# EAGLE schematic Mk4 Prototype (EAGLE 9.0.1)
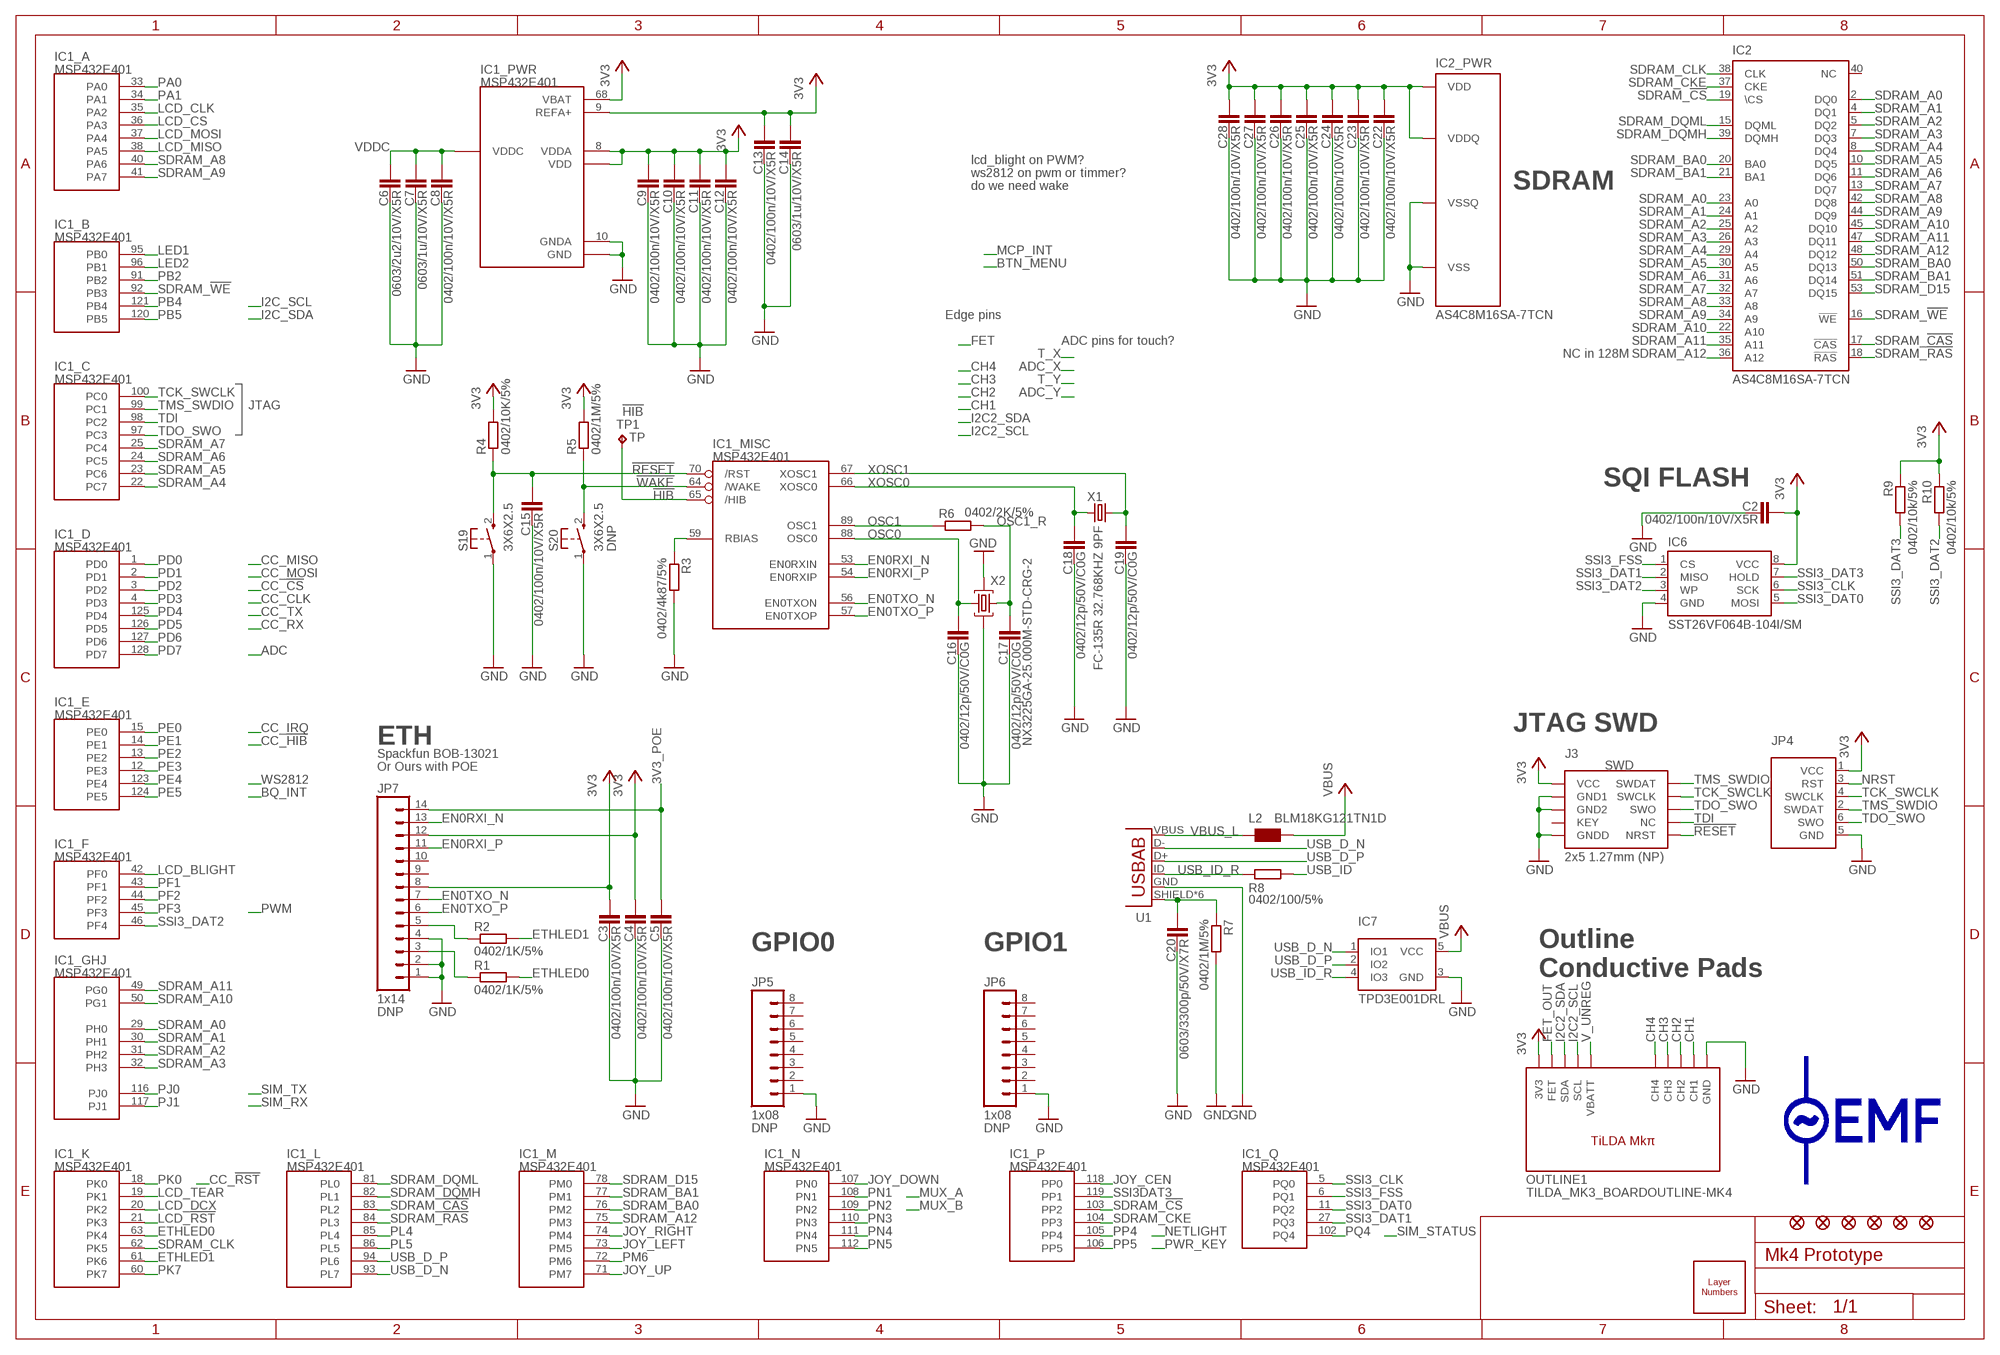
[diagram p0: schematic, sheet 1, part 1 of 2]
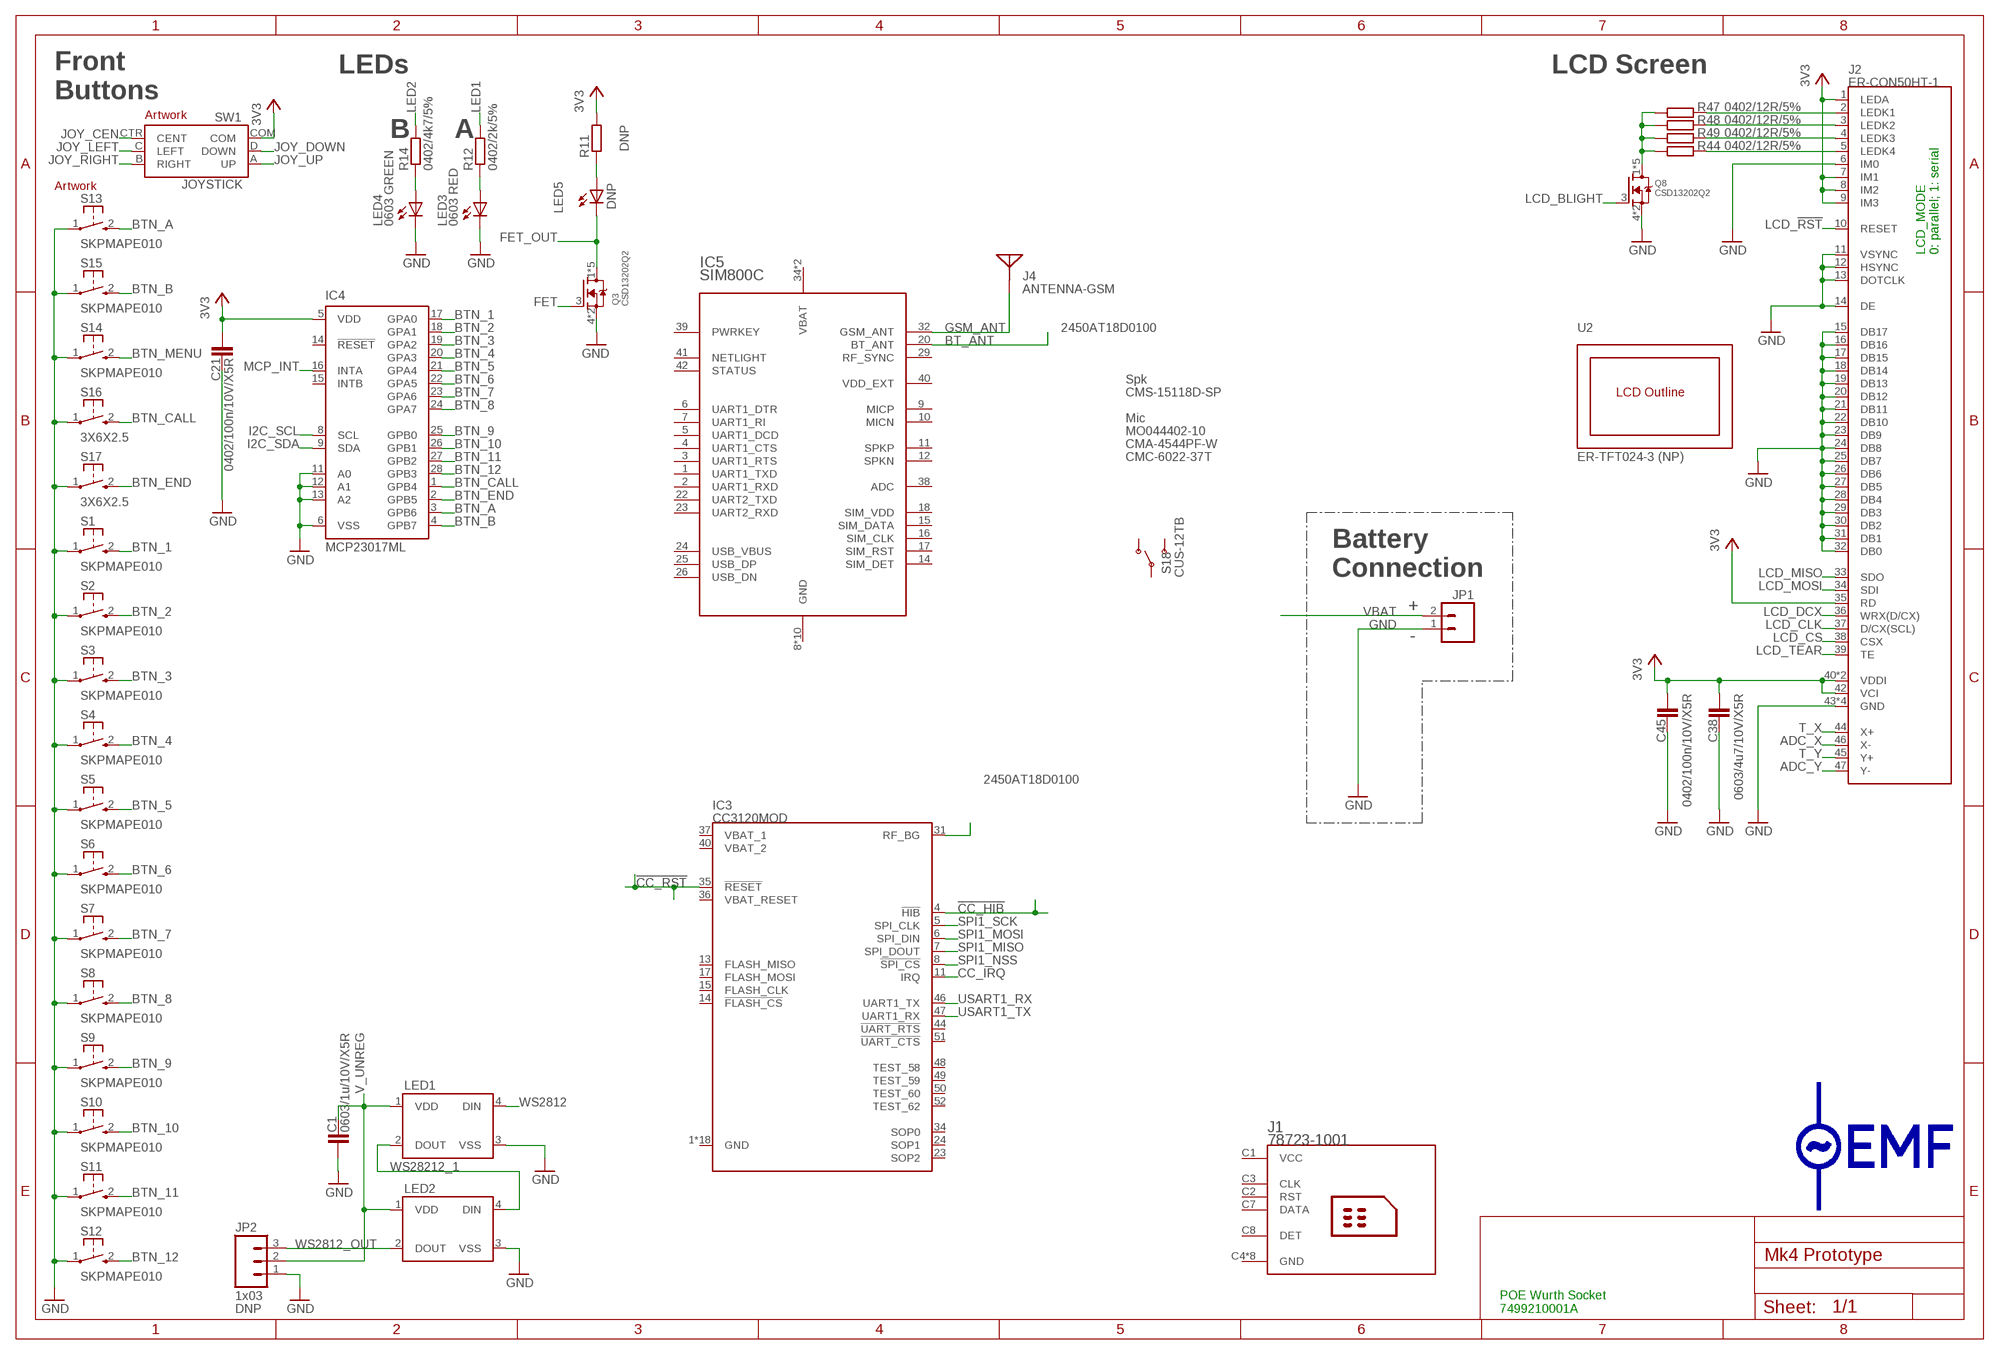
[diagram p1: schematic, sheet 1, part 2 of 2]

## Parts
ARTWORK1  ARTWORK_JOYSTICK  [TILDA_ARTWORK_JOYSTICK]
ARTWORK2  ARTWORK_KEYPAD  [TILDA_ARTWORK_KEYPAD]
C1  0603/1u/10V/X5R  C-EUC0603K-SMALL  [C0603K-SMALL]
C2  0402/100n/10V/X5R  C-EUC0402-SMALLER  [C0402-SMALLER]
C3  0402/100n/10V/X5R  C-EUC0402-SMALLER  [C0402-SMALLER]
C4  0402/100n/10V/X5R  C-EUC0402-SMALLER  [C0402-SMALLER]
C5  0402/100n/10V/X5R  C-EUC0402-SMALLER  [C0402-SMALLER]
C6  0603/2u2/10V/X5R  C-EUC0603K-SMALL  [C0603K-SMALL]
C7  0603/1u/10V/X5R  C-EUC0603K-SMALL  [C0603K-SMALL]
C8  0402/100n/10V/X5R  C-EUC0402-SMALLER  [C0402-SMALLER]
C9  0402/100n/10V/X5R  C-EUC0402-SMALLER  [C0402-SMALLER]
C10  0402/100n/10V/X5R  C-EUC0402-SMALLER  [C0402-SMALLER]
C11  0402/100n/10V/X5R  C-EUC0402-SMALLER  [C0402-SMALLER]
C12  0402/100n/10V/X5R  C-EUC0402-SMALLER  [C0402-SMALLER]
C13  0402/100n/10V/X5R  C-EUC0402-SMALLER  [C0402-SMALLER]
C14  0603/1u/10V/X5R  C-EUC0603K-SMALL  [C0603K-SMALL]
C15  0402/100n/10V/X5R  C-EUC0402-SMALLER  [C0402-SMALLER]
C16  0402/12p/50V/C0G  C-EUC0402-SMALLER  [C0402-SMALLER]
C17  0402/12p/50V/C0G  C-EUC0402-SMALLER  [C0402-SMALLER]
C18  0402/12p/50V/C0G  C-EUC0402-SMALLER  [C0402-SMALLER]
C19  0402/12p/50V/C0G  C-EUC0402-SMALLER  [C0402-SMALLER]
C20  0603/3300p/50V/X7R  C-EUC0603K-SMALL  [C0603K-SMALL]
C21  0402/100n/10V/X5R  C-EUC0402-SMALLER  [C0402-SMALLER]
C22  0402/100n/10V/X5R  C-EUC0402-SMALLER  [C0402-SMALLER]
C23  0402/100n/10V/X5R  C-EUC0402-SMALLER  [C0402-SMALLER]
C24  0402/100n/10V/X5R  C-EUC0402-SMALLER  [C0402-SMALLER]
C25  0402/100n/10V/X5R  C-EUC0402-SMALLER  [C0402-SMALLER]
C26  0402/100n/10V/X5R  C-EUC0402-SMALLER  [C0402-SMALLER]
C27  0402/100n/10V/X5R  C-EUC0402-SMALLER  [C0402-SMALLER]
C28  0402/100n/10V/X5R  C-EUC0402-SMALLER  [C0402-SMALLER]
C38  0603/4u7/10V/X5R  C-EUC0603K-SMALL  [C0603K-SMALL]
C45  0402/100n/10V/X5R  C-EUC0402-SMALLER  [C0402-SMALLER]
FID1  FIDUCIAL1X2.5-STOP  [FIDUCIAL-1X2.5-STOP]
FID2  FIDUCIAL1X2.5-STOP  [FIDUCIAL-1X2.5-STOP]
FID3  FIDUCIAL1X2.5-STOP  [FIDUCIAL-1X2.5-STOP]
FID4  FIDUCIAL1X2.5-STOP  [FIDUCIAL-1X2.5-STOP]
FID5  FIDUCIAL1X2.5-STOP  [FIDUCIAL-1X2.5-STOP]
FID6  FIDUCIAL1X2.5-STOP  [FIDUCIAL-1X2.5-STOP]
IC1  MSP432E401  [QFP128-0.4]
IC2  AS4C8M16SA-7TCN  MT48LCXXM16A2TG  [TSOP54-400]
IC3  CC3120MOD  [CC3100MOD-LWK]
IC4  MCP23017ML  [QFN28-ML_6X6MM]
IC5  SIM800C  [SIM800C]
IC6  SST26VF064B-104I/SM  SPI_FLASH-X25XXSMD1  [SO08-EIAJ]
IC7  TPD3E001DRL  [DRL-5]
J1  78723-1001  SIM-78723-1001-LWK  [MSIM-MOLEX-LWK]
J2  ER-CON50HT-1  ER-TFT024-3  [FH12-50S-0.5SH]
J3  2x5 1.27mm (NP)  SWD_SHROUD-PINHEAD  [PINHEAD_2X05_127]
J4  ANTENNA-GSM  [GSM-ANTENNA]
JP1  M02-JST-2MM-SMT  [JST-2-SMD]
JP2  1x03  M03LOCK  [1X03_LOCK]
JP4  (NP)  TC2030-SWDNL  [TC2030-MCP-NL]
JP5  1x08  M08LOCK  [1X08_LOCK]
JP6  1x08  M08LOCK  [1X08_LOCK]
JP7  1x14  M14LOCK  [1X14_LOCK]
L2  BLM18KG121TN1D  WE-CBF_0805  [WUERTH-0805]
LAYERS1  LAYER_NUMBRS_4_SMALL  [LAYER_NUMBERS_4_SMALL]
LED1  WS2812B  [WS2812B]
LED2  WS2812B  [WS2812B]
LED3  0603 RED  LED0603-CORRECT  [LED-0603-CORRECT]
LED4  0603 GREEN  LED0603-CORRECT  [LED-0603-CORRECT]
LED5  LED5MM  [LED5MM]
OUTLINE1  TILDA_MK3_BOARDOUTLINE-MK4  [TILDA_MK4_OUTLINE]
Q3  CSD13202Q2  [Q2]
Q8  CSD13202Q2  [Q2]
R1  0402/1K/5%  R-EU_R0402-SMALLER  [R0402-SMALLER]
R2  0402/1K/5%  R-EU_R0402-SMALLER  [R0402-SMALLER]
R3  0402/4k87/5%  R-EU_R0402-SMALLER  [R0402-SMALLER]
R4  0402/10K/5%  R-EU_R0402-SMALLER  [R0402-SMALLER]
R5  0402/1M/5%  R-EU_R0402-SMALLER  [R0402-SMALLER]
R6  0402/2K/5%  R-EU_R0402-SMALLER  [R0402-SMALLER]
R7  0402/1M/5%  R-EU_R0402-SMALLER  [R0402-SMALLER]
R8  0402/100/5%  R-EU_R0402-SMALLER  [R0402-SMALLER]
R9  0402/10k/5%  R-EU_R0402-SMALLER  [R0402-SMALLER]
R10  0402/10k/5%  R-EU_R0402-SMALLER  [R0402-SMALLER]
R11  R-EU_0309/10  [0309/10]
R12  0402/2k/5%  R-EU_R0402-SMALLER  [R0402-SMALLER]
R14  0402/4k7/5%  R-EU_R0402-SMALLER  [R0402-SMALLER]
R44  0402/12R/5%  R-EU_R0402-SMALLER  [R0402-SMALLER]
R47  0402/12R/5%  R-EU_R0402-SMALLER  [R0402-SMALLER]
R48  0402/12R/5%  R-EU_R0402-SMALLER  [R0402-SMALLER]
R49  0402/12R/5%  R-EU_R0402-SMALLER  [R0402-SMALLER]
S1  SKPMAPE010  TAC_SWITCH1-SKPMAPE010  [SKPMAPE010]
S2  SKPMAPE010  TAC_SWITCH1-SKPMAPE010  [SKPMAPE010]
S3  SKPMAPE010  TAC_SWITCH1-SKPMAPE010  [SKPMAPE010]
S4  SKPMAPE010  TAC_SWITCH1-SKPMAPE010  [SKPMAPE010]
S5  SKPMAPE010  TAC_SWITCH1-SKPMAPE010  [SKPMAPE010]
S6  SKPMAPE010  TAC_SWITCH1-SKPMAPE010  [SKPMAPE010]
S7  SKPMAPE010  TAC_SWITCH1-SKPMAPE010  [SKPMAPE010]
S8  SKPMAPE010  TAC_SWITCH1-SKPMAPE010  [SKPMAPE010]
S9  SKPMAPE010  TAC_SWITCH1-SKPMAPE010  [SKPMAPE010]
S10  SKPMAPE010  TAC_SWITCH1-SKPMAPE010  [SKPMAPE010]
S11  SKPMAPE010  TAC_SWITCH1-SKPMAPE010  [SKPMAPE010]
S12  SKPMAPE010  TAC_SWITCH1-SKPMAPE010  [SKPMAPE010]
S13  SKPMAPE010  TAC_SWITCH1-SKPMAPE010  [SKPMAPE010]
S14  SKPMAPE010  TAC_SWITCH1-SKPMAPE010  [SKPMAPE010]
S15  SKPMAPE010  TAC_SWITCH1-SKPMAPE010  [SKPMAPE010]
S16  3X6X2.5  TAC_SWITCH1-3X6X2.5  [TACTILE_SWITCH_SMD_3X6X2.5H]
S17  3X6X2.5  TAC_SWITCH1-3X6X2.5  [TACTILE_SWITCH_SMD_3X6X2.5H]
S18  CUS-12TB  SWITCH-SPST-SMD-A  [SWITCH-SPST-SMD-A]
S19  3X6X2.5  TAC_SWITCH1-3X6X2.5  [TACTILE_SWITCH_SMD_3X6X2.5H]
S20  3X6X2.5  TAC_SWITCH1-3X6X2.5  [TACTILE_SWITCH_SMD_3X6X2.5H]
SW1  JOYSTICK  JOYSTICK_MINI_MULTICOM_NOSILK  [JOYSTICK_MULTICOMP_NOSILK]
TP1  TP  TPB1,27  [B1,27]
U1  USB-AB-LWK  [USB-AB-MICRO-SMD_LWK]
U2  ER-TFT024-3 (NP)  ER-TFT024-3-OUTLINE  [ER-TFT024-3]
X1  FC-135R 32.768KHZ 9PF  RESONATOR_EPSON_FC_145  [RESONATOR_EPSON_FC_145]
X2  NX3225GA-25.000M-STD-CRG-2  CRYSTAL-3.2-2.5  [CRYSTAL-3.2-2.5]

## Nets
3V3: C2.2 C3.2 C4.2 C9.2 C10.2 C11.2 C12.2 C13.2 C14.2 C21.2 C22.2 C23.2 C24.2 C25.2 C26.2 C27.2 C28.2 C38.2 C45.2 IC1.7(_PWR:VDD) IC1.8(_PWR:VDDA) IC1.9(_PWR:REFA+) IC1.16(_PWR:VDD) IC1.26(_PWR:VDD) IC1.28(_PWR:VDD) IC1.39(_PWR:VDD) IC1.47(_PWR:VDD) IC1.51(_PWR:VDD) IC1.52(_PWR:VDD) IC1.68(_PWR:VBAT) IC1.69(_PWR:VDD) IC1.79(_PWR:VDD) IC1.90(_PWR:VDD) IC1.101(_PWR:VDD) IC1.113(_PWR:VDD) IC1.122(_PWR:VDD) IC2.1(VDD) IC2.3(VDDQ) IC2.9(VDDQ) IC2.14(VDD) IC2.27(VDD) IC2.43(VDDQ) IC2.49(VDDQ) IC4.5(VDD) IC6.8(VCC) J2.1(LEDA) J2.7(IM1) J2.8(IM2) J2.9(IM3) J2.35(RD) J2.40(VDDI) J2.41(VDDI) J2.42(VCI) J3.1(VCC) JP4.1(VCC) JP7.8 JP7.12 OUTLINE1.3V3 R4.2 R5.2 R9.1 R10.1 R11.2 SW1.COM
3V3_POE: C5.2 JP7.14
!CC_HIB: IC3.4(!HIB)
!CC_RST: IC3.35(!RESET)
!HIB: IC1.65(_MISC:/HIB) TP1.TP
!RESET: C15.2 IC1.70(_MISC:/RST) J3.10(NRST) R4.1 S19.2
!WAKE: IC1.64(_MISC:/WAKE) R5.1 S20.2
ADC_X: J2.46(X-)
ADC_Y: J2.47(Y-)
BT_ANT: IC5.20(BT_ANT)
BTN_1: IC4.17(GPA0) S1.2
BTN_2: IC4.18(GPA1) S2.2
BTN_3: IC4.19(GPA2) S3.2
BTN_4: IC4.20(GPA3) S4.2
BTN_5: IC4.21(GPA4) S5.2
BTN_6: IC4.22(GPA5) S6.2
BTN_7: IC4.23(GPA6) S7.2
BTN_8: IC4.24(GPA7) S8.2
BTN_9: IC4.25(GPB0) S9.2
BTN_10: IC4.26(GPB1) S10.2
BTN_11: IC4.27(GPB2) S11.2
BTN_12: IC4.28(GPB3) S12.2
BTN_A: IC4.3(GPB6) S13.2
BTN_B: IC4.4(GPB7) S15.2
BTN_CALL: IC4.1(GPB4) S16.2
BTN_END: IC4.2(GPB5) S17.2
BTN_MENU: S14.2
CC_IRQ: IC3.11(IRQ)
CH1: OUTLINE1.CH4(CH1)
CH2: OUTLINE1.CH3(CH2)
CH3: OUTLINE1.CH2(CH3)
CH4: OUTLINE1.CH1(CH4)
EN0RXI_N [100R]: IC1.53(_MISC:EN0RXIN) JP7.13
EN0RXI_P [100R]: IC1.54(_MISC:EN0RXIP) JP7.11
EN0TXO_N [100R]: IC1.56(_MISC:EN0TXON) JP7.7
EN0TXO_P [100R]: IC1.57(_MISC:EN0TXOP) JP7.6
ETHLED0: IC1.63(_K:PK4) R1.2
ETHLED1: IC1.61(_K:PK6) R2.2
FET: Q3.3(G)
FET_OUT: LED5.K(C) OUTLINE1.FET Q3.1(D) Q3.2(D) Q3.5(D) Q3.6(D) Q3.EP1(D)
GND: C1.2 C2.1 C3.1 C4.1 C5.1 C6.1 C7.1 C8.1 C9.1 C10.1 C11.1 C12.1 C13.1 C14.1 C15.1 C16.1 C17.1 C18.1 C19.1 C20.1 C21.1 C22.1 C23.1 C24.1 C25.1 C26.1 C27.1 C28.1 C38.1 C45.1 IC1.10(_PWR:GNDA) IC1.17(_PWR:GND) IC1.48(_PWR:GND) IC1.55(_PWR:GND) IC1.58(_PWR:GND) IC1.80(_PWR:GND) IC1.114(_PWR:GND) IC2.6(VSSQ) IC2.12(VSSQ) IC2.28(VSS) IC2.41(VSS) IC2.46(VSSQ) IC2.52(VSSQ) IC2.54(VSS) IC4.6(VSS) IC4.11(A0) IC4.12(A1) IC4.13(A2) IC6.4(GND) IC7.3(GND) J2.6(IM0) J2.11(VSYNC) J2.12(HSYNC) J2.13(DOTCLK) J2.14(DE) J2.15(DB17) J2.16(DB16) J2.17(DB15) J2.18(DB14) J2.19(DB13) J2.20(DB12) J2.21(DB11) J2.22(DB10) J2.23(DB9) J2.24(DB8) J2.25(DB7) J2.26(DB6) J2.27(DB5) J2.28(DB4) J2.29(DB3) J2.30(DB2) J2.31(DB1) J2.32(DB0) J2.43(GND) J2.48(GND) J2.49(GND) J2.50(GND) J3.3(GND1) J3.5(GND2) J3.9(GNDD) JP1.1 JP2.1 JP4.5(GND) JP5.1 JP6.1 JP7.1 JP7.2 JP7.4 LED1.3(VSS) LED2.3(VSS) LED3.C LED4.C OUTLINE1.GND Q3.4(S) Q3.EP2(S) Q8.4(S) Q8.EP2(S) R3.2 R7.2 S1.1 S2.1 S3.1 S4.1 S5.1 S6.1 S7.1 S8.1 S9.1 S10.1 S11.1 S12.1 S13.1 S14.1 S15.1 S16.1 S17.1 S19.1 S20.1 U1.GND X2.2(GND) X2.4(GND)
GSM_ANT: IC5.32(GSM_ANT) J4.ANT
I2C2_SCL: OUTLINE1.SCL
I2C2_SDA: OUTLINE1.SDA
I2C_SCL: IC4.8(SCL)
I2C_SDA: IC4.9(SDA)
JOY_CEN: IC1.118(_P:PP0) SW1.CTR(CENT)
JOY_DOWN: IC1.107(_N:PN0) SW1.D(DOWN)
JOY_LEFT: IC1.73(_M:PM5) SW1.C(LEFT)
JOY_RIGHT: IC1.74(_M:PM4) SW1.B(RIGHT)
JOY_UP: IC1.71(_M:PM7) SW1.A(UP)
LCD_!RST: IC1.21(_K:PK3) J2.10(RESET)
LCD_BLIGHT: IC1.42(_F:PF0) Q8.3(G)
LCD_CLK: IC1.35(_A:PA2) J2.37(D/CX(SCL))
LCD_CS: IC1.36(_A:PA3) J2.38(CSX)
LCD_DCX: IC1.20(_K:PK2) J2.36(WRX(D/CX))
LCD_MISO: IC1.38(_A:PA5) J2.33(SDO)
LCD_MOSI: IC1.37(_A:PA4) J2.34(SDI)
LCD_TEAR: IC1.19(_K:PK1) J2.39(TE)
LED1: IC1.95(_B:PB0) R12.2
LED2: IC1.96(_B:PB1) R14.2
LEDK1: J2.2(LEDK1) R47.2
LEDK2: J2.3(LEDK2) R48.2
LEDK3: J2.4(LEDK3) R49.2
LEDK4: J2.5(LEDK4) R44.2
MCP_INT: IC4.16(INTA)
N$1: LED5.A R11.1
N$3: JP7.3 R1.1
N$4: JP7.5 R2.1
N$5: IC1.59(_MISC:RBIAS) R3.1
N$6: C20.2 R7.1 U1.SHIELD U1.SHIELD@0(SHIELD) U1.SHIELD@1(SHIELD) U1.SHIELD@2(SHIELD) U1.SHIELD@3(SHIELD) U1.SHIELD@5(SHIELD)
N$36: IC3.31(RF_BG)
N$51: LED4.A R14.1
N$52: LED3.A R12.1
N$64: Q8.1(D) Q8.2(D) Q8.5(D) Q8.6(D) Q8.EP1(D) R44.1 R47.1 R48.1 R49.1
NRST: JP4.3(RST)
OSC0: C16.2 IC1.88(_MISC:OSC0) X2.1(C1)
OSC1: IC1.89(_MISC:OSC1) R6.1
OSC1_R: C17.2 R6.2 X2.3(C2)
PA0: IC1.33(_A:PA0)
PA1: IC1.34(_A:PA1)
PB2: IC1.91(_B:PB2)
PB4: IC1.121(_B:PB4)
PB5: IC1.120(_B:PB5)
PD0: IC1.1(_D:PD0)
PD1: IC1.2(_D:PD1)
PD2: IC1.3(_D:PD2)
PD3: IC1.4(_D:PD3)
PD4: IC1.125(_D:PD4)
PD5: IC1.126(_D:PD5)
PD6: IC1.127(_D:PD6)
PD7: IC1.128(_D:PD7)
PE0: IC1.15(_E:PE0)
PE1: IC1.14(_E:PE1)
PE2: IC1.13(_E:PE2)
PE3: IC1.12(_E:PE3)
PE4: IC1.123(_E:PE4)
PE5: IC1.124(_E:PE5)
PF1: IC1.43(_F:PF1)
PF2: IC1.44(_F:PF2)
PF3: IC1.45(_F:PF3)
PJ0: IC1.116(_GHJ:PJ0)
PJ1: IC1.117(_GHJ:PJ1)
PK0: IC1.18(_K:PK0)
PK7: IC1.60(_K:PK7)
PL4: IC1.85(_L:PL4)
PL5: IC1.86(_L:PL5)
PM6: IC1.72(_M:PM6)
PN1: IC1.108(_N:PN1)
PN2: IC1.109(_N:PN2)
PN3: IC1.110(_N:PN3)
PN4: IC1.111(_N:PN4)
PN5: IC1.112(_N:PN5)
PP4: IC1.105(_P:PP4)
PP5: IC1.106(_P:PP5)
PQ4: IC1.102(_Q:PQ4)
SDRAM_!CAS: IC1.83(_L:PL2) IC2.17(!CAS)
SDRAM_!CS: IC1.103(_P:PP2) IC2.19(\CS)
SDRAM_!RAS: IC1.84(_L:PL3) IC2.18(!RAS)
SDRAM_!WE: IC1.92(_B:PB3) IC2.16(!WE)
SDRAM_A0: IC1.29(_GHJ:PH0) IC2.2(DQ0) IC2.23(A0)
SDRAM_A1: IC1.30(_GHJ:PH1) IC2.4(DQ1) IC2.24(A1)
SDRAM_A2: IC1.31(_GHJ:PH2) IC2.5(DQ2) IC2.25(A2)
SDRAM_A3: IC1.32(_GHJ:PH3) IC2.7(DQ3) IC2.26(A3)
SDRAM_A4: IC1.22(_C:PC7) IC2.8(DQ4) IC2.29(A4)
SDRAM_A5: IC1.23(_C:PC6) IC2.10(DQ5) IC2.30(A5)
SDRAM_A6: IC1.24(_C:PC5) IC2.11(DQ6) IC2.31(A6)
SDRAM_A7: IC1.25(_C:PC4) IC2.13(DQ7) IC2.32(A7)
SDRAM_A8: IC1.40(_A:PA6) IC2.33(A8) IC2.42(DQ8)
SDRAM_A9: IC1.41(_A:PA7) IC2.34(A9) IC2.44(DQ9)
SDRAM_A10: IC1.50(_GHJ:PG1) IC2.22(A10) IC2.45(DQ10)
SDRAM_A11: IC1.49(_GHJ:PG0) IC2.35(A11) IC2.47(DQ11)
SDRAM_A12: IC1.75(_M:PM3) IC2.36(A12) IC2.48(DQ12)
SDRAM_BA0: IC1.76(_M:PM2) IC2.20(BA0) IC2.50(DQ13)
SDRAM_BA1: IC1.77(_M:PM1) IC2.21(BA1) IC2.51(DQ14)
SDRAM_CKE: IC1.104(_P:PP3) IC2.37(CKE)
SDRAM_CLK: IC1.62(_K:PK5) IC2.38(CLK)
SDRAM_D15: IC1.78(_M:PM0) IC2.53(DQ15)
SDRAM_DQMH: IC1.82(_L:PL1) IC2.39(DQMH)
SDRAM_DQML: IC1.81(_L:PL0) IC2.15(DQML)
SPI1_MISO: IC3.7(SPI_DOUT)
SPI1_MOSI: IC3.6(SPI_DIN)
SPI1_NSS: IC3.8(!SPI_CS)
SPI1_SCK: IC3.5(SPI_CLK)
SSI3_CLK: IC1.5(_Q:PQ0) IC6.6(SCK)
SSI3_DAT0: IC1.11(_Q:PQ2) IC6.5(MOSI)
SSI3_DAT1: IC1.27(_Q:PQ3) IC6.2(MISO)
SSI3_DAT2: IC1.46(_F:PF4) IC6.3(WP) R10.2
SSI3_DAT3: IC6.7(HOLD) R9.2
SSI3_FSS: IC1.6(_Q:PQ1) IC6.1(CS)
SSI3DAT3: IC1.119(_P:PP1)
T_X: J2.44(X+)
T_Y: J2.45(Y+)
TCK_SWCLK: IC1.100(_C:PC0) J3.4(SWCLK) JP4.4(SWCLK)
TDI: IC1.98(_C:PC2) J3.8(NC)
TDO_SWO: IC1.97(_C:PC3) J3.6(SWO) JP4.6(SWO)
TMS_SWDIO: IC1.99(_C:PC1) J3.2(SWDAT) JP4.2(SWDAT)
USART1_RX: IC3.46(UART1_TX)
USART1_TX: IC3.47(UART1_RX)
USB_D_N [90R]: IC1.93(_L:PL7) IC7.1(IO1) U1.D-
USB_D_P [90R]: IC1.94(_L:PL6) IC7.2(IO2) U1.D+
USB_ID: R8.2
USB_ID_R: IC7.4(IO3) R8.1 U1.ID(USBID)
V_UNREG: C1.1 JP2.2 LED1.1(VDD) LED2.1(VDD) OUTLINE1.VBATT
VBAT: JP1.2
VBUS: IC7.5(VCC) L2.2
VBUS_L: L2.1 U1.VBUS
VDDC: C6.2 C7.2 C8.2 IC1.87(_PWR:VDDC) IC1.115(_PWR:VDDC)
WS2812: LED1.4(DIN)
WS2812_OUT: JP2.3 LED2.2(DOUT)
WS28212_1: LED1.2(DOUT) LED2.4(DIN)
XOSC0: C18.2 IC1.66(_MISC:XOSC0) X1.P$1
XOSC1: C19.2 IC1.67(_MISC:XOSC1) X1.P$2
Unconnected: IC2.40(NC) IC3.13(FLASH_MISO) IC3.14(!FLASH_CS) IC3.15(FLASH_CLK) IC3.17(FLASH_MOSI) IC3.23(SOP2) IC3.24(SOP1) IC3.34(SOP0) IC3.36(VBAT_RESET) IC3.44(!UART_RTS) IC3.48(TEST_58) IC3.49(TEST_59) IC3.50(TEST_60) IC3.51(!UART_CTS) IC3.52(TEST_62) IC4.14(!RESET) IC4.15(INTB) IC5.1(UART1_TXD) IC5.2(UART1_RXD) IC5.3(UART1_RTS) IC5.4(UART1_CTS) IC5.5(UART1_DCD) IC5.6(UART1_DTR) IC5.7(UART1_RI) IC5.9(MICP) IC5.10(MICN) IC5.11(SPKP) IC5.12(SPKN) IC5.14(SIM_DET) IC5.15(SIM_DATA) IC5.16(SIM_CLK) IC5.17(SIM_RST) IC5.22(UART2_TXD) IC5.23(UART2_RXD) IC5.25(USB_DP) IC5.26(USB_DN) IC5.29(RF_SYNC) IC5.38(ADC) IC5.39(PWRKEY) IC5.41(NETLIGHT) IC5.42(STATUS) J1.C2(RST) J1.C3(CLK) J1.C7(DATA) J1.C8(DET) J3.7(KEY) JP5.2 JP5.3 JP5.4 JP5.5 JP5.6 JP5.7 JP5.8 JP6.2 JP6.3 JP6.4 JP6.5 JP6.6 JP6.7 JP6.8 JP7.9 JP7.10 S18.1(O) S18.2(P) S18.3(S)

## Notes on the sheet
- LEDs | LCD Screen
- Front 
  Buttons
- B | A
- lcd_blight on PWM?
- ws2812 on pwm or timmer?
- do we need wake | SDRAM
- LCD_MODE
  0: parallel; 1: serial
- Edge pins
- 2450AT18D0100
- ADC pins for touch?
- NC in 128M
- Spk
- CMS-15118D-SP
- JTAG
- Mic
- MO044402-10
- CMA-4544PF-W
- CMC-6022-37T
- SQI FLASH
- Battery
  Connection
- +
- -
- JTAG SWD
- ETH
- Spackfun BOB-13021
- Or Ours with POE
- 2450AT18D0100
- GPIO0 | GPIO1
- Outline
  Conductive Pads
- POE Wurth Socket
  7499210001A

## Power pins joined to a net without a drawn wire
GND: IC3.1(GND) IC3.2(GND) IC3.16(GND) IC3.27(GND) IC3.28(GND) IC3.30(GND) IC3.32(GND) IC3.38(GND) IC3.43(GND) IC3.55(GND) IC3.56(GND) IC3.57(GND) IC3.58(GND) IC3.59(GND) IC3.60(GND) IC3.61(GND) IC3.62(GND) IC3.63(GND) IC5.8(GND) IC5.13(GND) IC5.19(GND) IC5.21(GND) IC5.27(GND) IC5.30(GND) IC5.31(GND) IC5.33(GND) IC5.36(GND) IC5.37(GND) J1.C4(GND) J1.C5(GND) J1.GND1(GND) J1.GND2(GND) J1.GND3(GND) J1.GND4(GND) J1.GND5(GND) J1.GND6(GND)
SIM_VDD: IC5.18(SIM_VDD)
USB_VBUS: IC5.24(USB_VBUS)
VBAT: IC5.34(VBAT) IC5.35(VBAT)
VBAT_1: IC3.37(VBAT_1)
VBAT_2: IC3.40(VBAT_2)
VCC: J1.C1(VCC)
VDD_EXT: IC5.40(VDD_EXT)

## Library data of the parts
ARTWORK1 ARTWORK2 = TiLDA Mk4 Parts:ARTWORK
C1-C28 C38 C45 = TiLDA Mk4 Parts:C-EU: CAPACITOR, European symbol
FID1-FID6 = TiLDA Mk4 Parts:FIDUCIAL: Fiducial Alignment Points Various fiducial points for machine vision alignment.
IC1 = TiLDA Mk4 Parts:MSP432E401
IC2 = TiLDA Mk4 Parts:MT48LCXXM16A2
IC3 = TiLDA Mk4 Parts:CC3120MOD
IC4 = TiLDA Mk4 Parts:MCP23017: http://ww1.microchip.com/downloads/en/DeviceDoc/21952a.pdf Source: http://ww1.microchip.com/downloads/en/DeviceDoc/21952a.pdf
IC5 = TiLDA Mk4 Parts:SIM800C
IC6 = TiLDA Mk4 Parts:SPI_FLASH-X25XX: 8pin SPI Flash series x25xx. Works with devices like W25X32 and BR25L32
IC7 = TiLDA Mk4 Parts:TPD3E001
J1 = TiLDA Mk4 Parts:SIM-78723-1001
J2 = TiLDA Mk4 Parts:ER-TFT024-3
J3 = TiLDA Mk4 Parts:SWD_SHROUD; FARNELL: 1865285
J4 = TiLDA Mk4 Parts:ANTENNA
JP1 = TiLDA Mk4 Parts:M02: Header 2 Standard 2-pin 0.1" header. Use with straight break away headers (SKU : PRT-00116), right angle break away headers (PRT-00553), swiss pins (PRT-00743), machine pins (PRT-00117), and female headers (PRT-00115). Molex polarized connector foot print use with SKU : PRT-08233 with associated crimp pins and housings.
JP2 = TiLDA Mk4 Parts:M03: Header 3 Standard 3-pin 0.1" header. Use with straight break away headers (SKU : PRT-00116), right angle break away headers (PRT-00553), swiss pins (PRT-00743), machine pins (PRT-00117), and female headers (PRT-00115). Molex polarized connector foot print use with SKU : PRT-08232 with associated crimp pins and housings.; DNP: Y
JP4 = TiLDA Mk4 Parts:TC2030-SWD
JP5 JP6 = TiLDA Mk4 Parts:M08: Header 8 Standard 8-pin 0.1" header. Use with straight break away headers (SKU : PRT-00116), right angle break away headers (PRT-00553), swiss pins (PRT-00743), machine pins (PRT-00117), and female headers (PRT-00115).; DNP: Y
JP7 = TiLDA Mk4 Parts:M14: Header 14 Standard 14-pin 0.1" header. Use with straight break away headers (SKU : PRT-00116), right angle break away headers (PRT-00553), swiss pins (PRT-00743), machine pins (PRT-00117), and female headers (PRT-00115).; DNP: Y
L2 = TiLDA Mk4 Parts:WE-CBF: SMD EMI Suppression Ferrite Beads - excellent anti-EMI properties - low DCR - impedances till 3000 ohms - rated current up to 6 A; FARNELL: 1781089
LAYERS1 = TiLDA Mk4 Parts:LAYER_NUMBRS
LED1 LED2 = TiLDA Mk4 Parts:WS2812B: WS2812B - Intelligent control LED integrated light source Technical Specifications: Power Supply Voltage (VDD): 3.5 to 5.3 V Input Voltage (VI): -0.5 to VDD+0.5 V Operating Junction Temperature (Topt): -25°C to +80°C Storage Temperature Range (Tstg): -55°C to +150°C
LED3 = TiLDA Mk4 Parts:LED: LEDs Standard schematic elements and footprints for 5mm, 3mm, 1206, and 0603 sized LEDs. 5mm - Spark Fun Electronics SKU : COM-00529 (and others); COLOUR: RED; FARNELL: 2449874
LED4 = TiLDA Mk4 Parts:LED: LEDs Standard schematic elements and footprints for 5mm, 3mm, 1206, and 0603 sized LEDs. 5mm - Spark Fun Electronics SKU : COM-00529 (and others); COLOUR: GREEN; FARNELL: 2426215
LED5 = TiLDA Mk4 Parts:LED: LEDs Standard schematic elements and footprints for 5mm, 3mm, 1206, and 0603 sized LEDs. 5mm - Spark Fun Electronics SKU : COM-00529 (and others); DNP: Y
OUTLINE1 = TiLDA Mk4 Parts:TILDA_MK3_BOARDOUTLINE
Q3 = TiLDA Mk3 Parts:CSD13202Q2; FARNELL: 2501084
Q8 = TiLDA Mk4 Parts:CSD13202Q2; FARNELL: 2501084
R1-R10 R12 R14 = TiLDA Mk4 Parts:R-EU_: RESISTOR, European symbol
R11 = TiLDA Mk4 Parts:R-EU_: RESISTOR, European symbol; DNP: Y
R44 R47-R49 = TiLDA Mk4 Parts:R-EU_: RESISTOR, European symbol; FARNELL: 9331280; FARNELL_REEL: 2130678
S1-S17 S19 = TiLDA Mk4 Parts:TAC_SWITCH1
S18 = TiLDA Mk4 Parts:SWITCH-SPST: SPST Switch Simple slide switch. Spark Fun Electronics SKU : COM-00102; FARNELL: 9575146
S20 = TiLDA Mk4 Parts:TAC_SWITCH1; DNP: Y
SW1 = TiLDA Mk4 Parts:JOYSTICK_MINI; FARNELL: 1316987
TP1 = TiLDA Mk4 Parts:TP: Test pad; TP_SIGNAL_NAME: !HIB
U1 = TiLDA Mk4 Parts:USB-AB: This is a USB AB connector that is compatible with USB OTG. i.e. this connector can serve as a host or device
U2 = TiLDA Mk4 Parts:ER-TFT024-3-OUTLINE
X1 = TiLDA Mk4 Parts:RESONATOR_EPSON_FC_145
X2 = TiLDA Mk4 Parts:CRYSTAL

## Net classes
1 ANT: width 1.27 mm, drill 0.4 mm, clearance 0.4 mm
2 90R: drill 0.3 mm
3 100R: drill 0.3 mm
4 5V0: width 0.406 mm, drill 0.3 mm, clearance 0.6 mm to class 2, clearance 0.6 mm to class 3
5 3V3: width 0.254 mm, drill 0.3 mm, clearance 0.6 mm to class 2, clearance 0.6 mm to class 3
6 1V8: width 0.254 mm, drill 0.3 mm, clearance 0.6 mm to class 2, clearance 0.6 mm to class 3
7 H5V0: width 0.254 mm, drill 0.3 mm, clearance 0.6 mm to class 2, clearance 0.6 mm to class 3
8 MAINS: clearance 4 mm to class 0, clearance 4 mm to class 1, clearance 4 mm to class 2, clearance 4 mm to class 3, clearance 4 mm to class 4, clearance 4 mm to class 5, clearance 4 mm to class 6, clearance 4 mm to class 7, clearance 4 mm